# EasyEDA schematic Sheet_1.json
TITLE: Sheet_1; REV: 1.0; Date: 2024-08-13; Sheet: 1/1; Drawn By: k754a; Company: Your Company
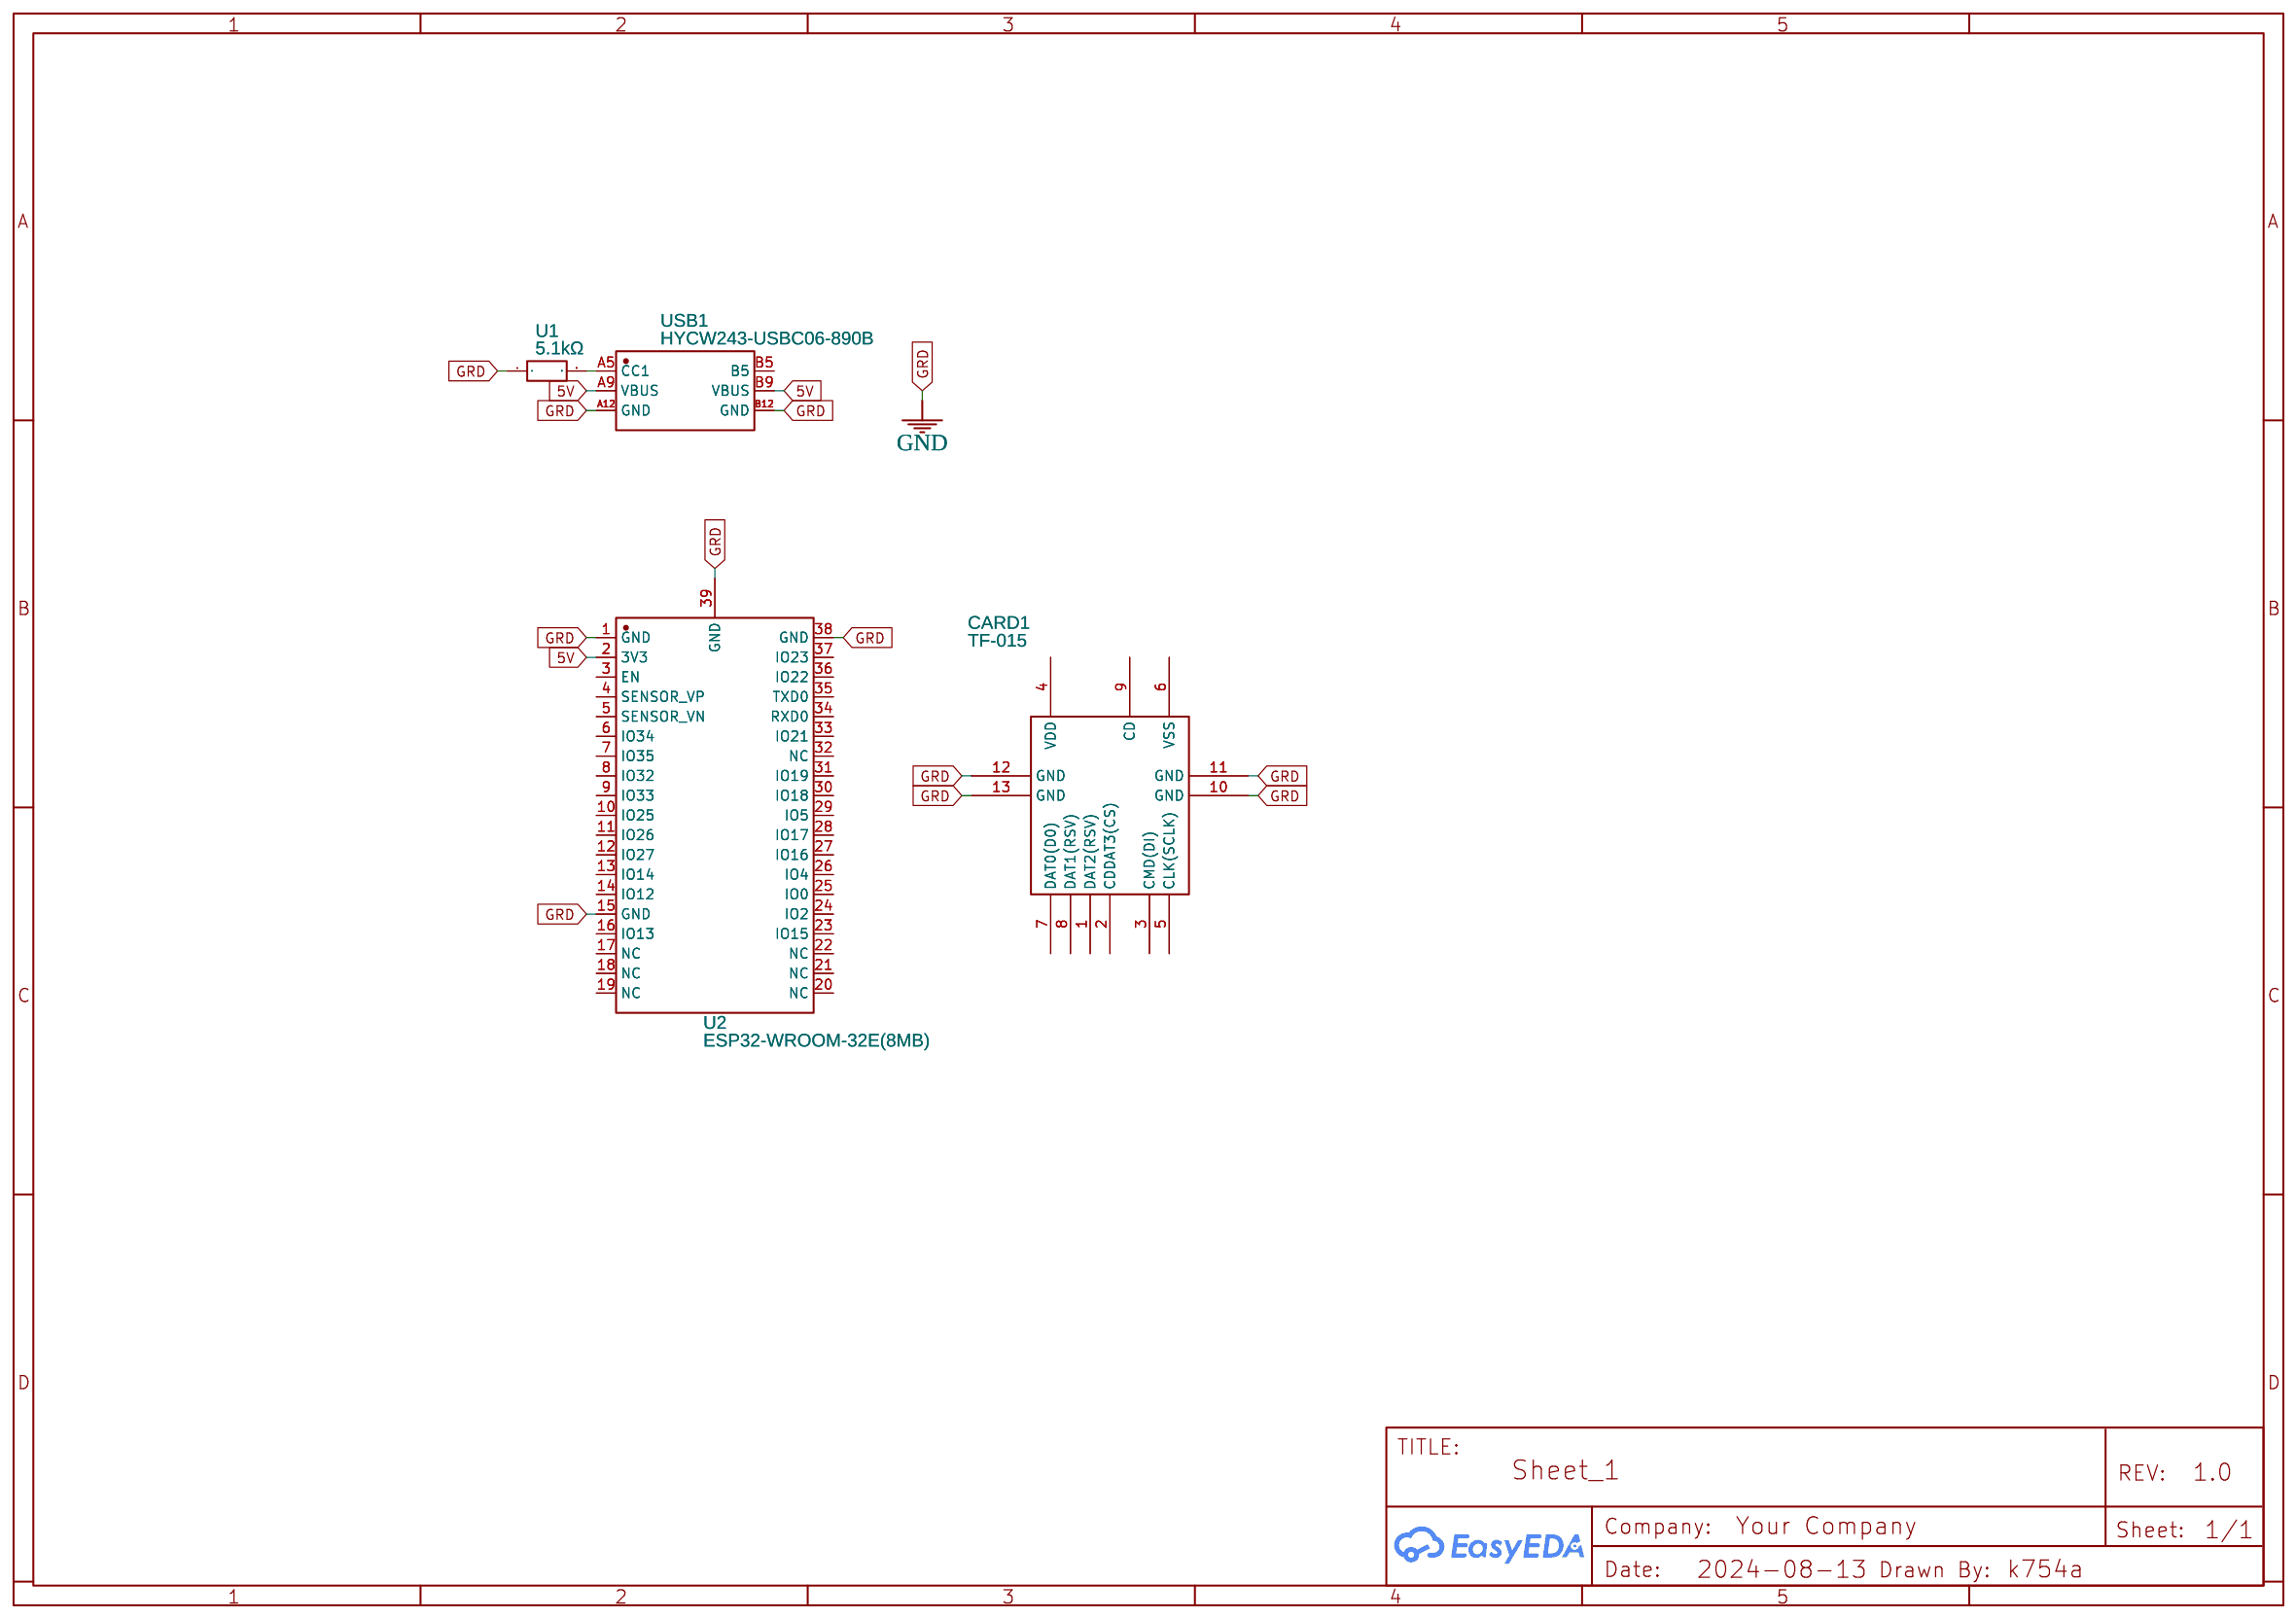
[diagram p0: schematic sheet]

## Parts
CARD1  TF-015  [TF-SMD_TF-015]
U1  5.1kΩ  [RES-TH_BD2.3-L3.7-P7.70-D0.4]
U2  ESP32-WROOM-32E(8MB)  [WIFI-SMD_ESP32-WROOM-32E]
USB1  HYCW243-USBC06-890B  [USB-TYPE-C_6P_HYCW243-USBC06-890B]

## Library data of the parts
CARD1 = TF-015: Supplier: LCSC; Manufacturer: SOFNG(硕方); Supplier Part: C113206; JLCPCB Part Class: Extended Part
U1 = CR1/8W-5K1±5%-ST52: Contributor: lcsc; Supplier: LCSC; Supplier Part: C2897081; Manufacturer: VO(翔胜); JLCPCB Part Class: Extended Part
U2 = ESP32-WROOM-32E(8MB): Contributor: LCSC; Supplier: LCSC; Supplier Part: C701342; Manufacturer: ESPRESSIF(乐鑫); Manufacturer Part: ESP32-WROOM-32E-N8; JLCPCB Part Class: Extended Part
USB1 = HYCW243-USBC06-890B: Contributor: lcsc; Supplier: LCSC; Supplier Part: C3034192; Manufacturer: 华宇创; JLCPCB Part Class: Extended Part

## Nets
5V: U2.2(3V3) USB1.A9(VBUS) USB1.B9(VBUS)
GND: CARD1.10(GND) CARD1.11(GND) CARD1.12(GND) CARD1.13(GND) U1.1 U2.1(GND) U2.15(GND) U2.38(GND) U2.39(GND) USB1.A12(GND) USB1.B12(GND)
Net-(U1-2): U1.2 USB1.A5(CC1)

Not connected (* = marked no-connect by the designer): CARD1 1(DAT2(RSV)) 2(CDDAT3(CS)) 3(CMD(DI)) 4(VDD) 5(CLK(SCLK)) 6(VSS) 7(DAT0(D0)) 8(DAT1(RSV)) 9(CD); U2 3(EN) 4(SENSOR_VP) 5(SENSOR_VN) 6(IO34) 7(IO35) 8(IO32) 9(IO33) 10(IO25) 11(IO26) 12(IO27) 13(IO14) 14(IO12) 16(IO13) 17(NC) 18(NC) 19(NC) 20(NC) 21(NC) 22(NC) 23(IO15) 24(IO2) 25(IO0) 26(IO4) 27(IO16) 28(IO17) 29(IO5) 30(IO18) 31(IO19) 32(NC) 33(IO21) 34(RXD0) 35(TXD0) 36(IO22) 37(IO23); USB1 B5
